# EAGLE design PSU-v2 (EAGLE 5.07)
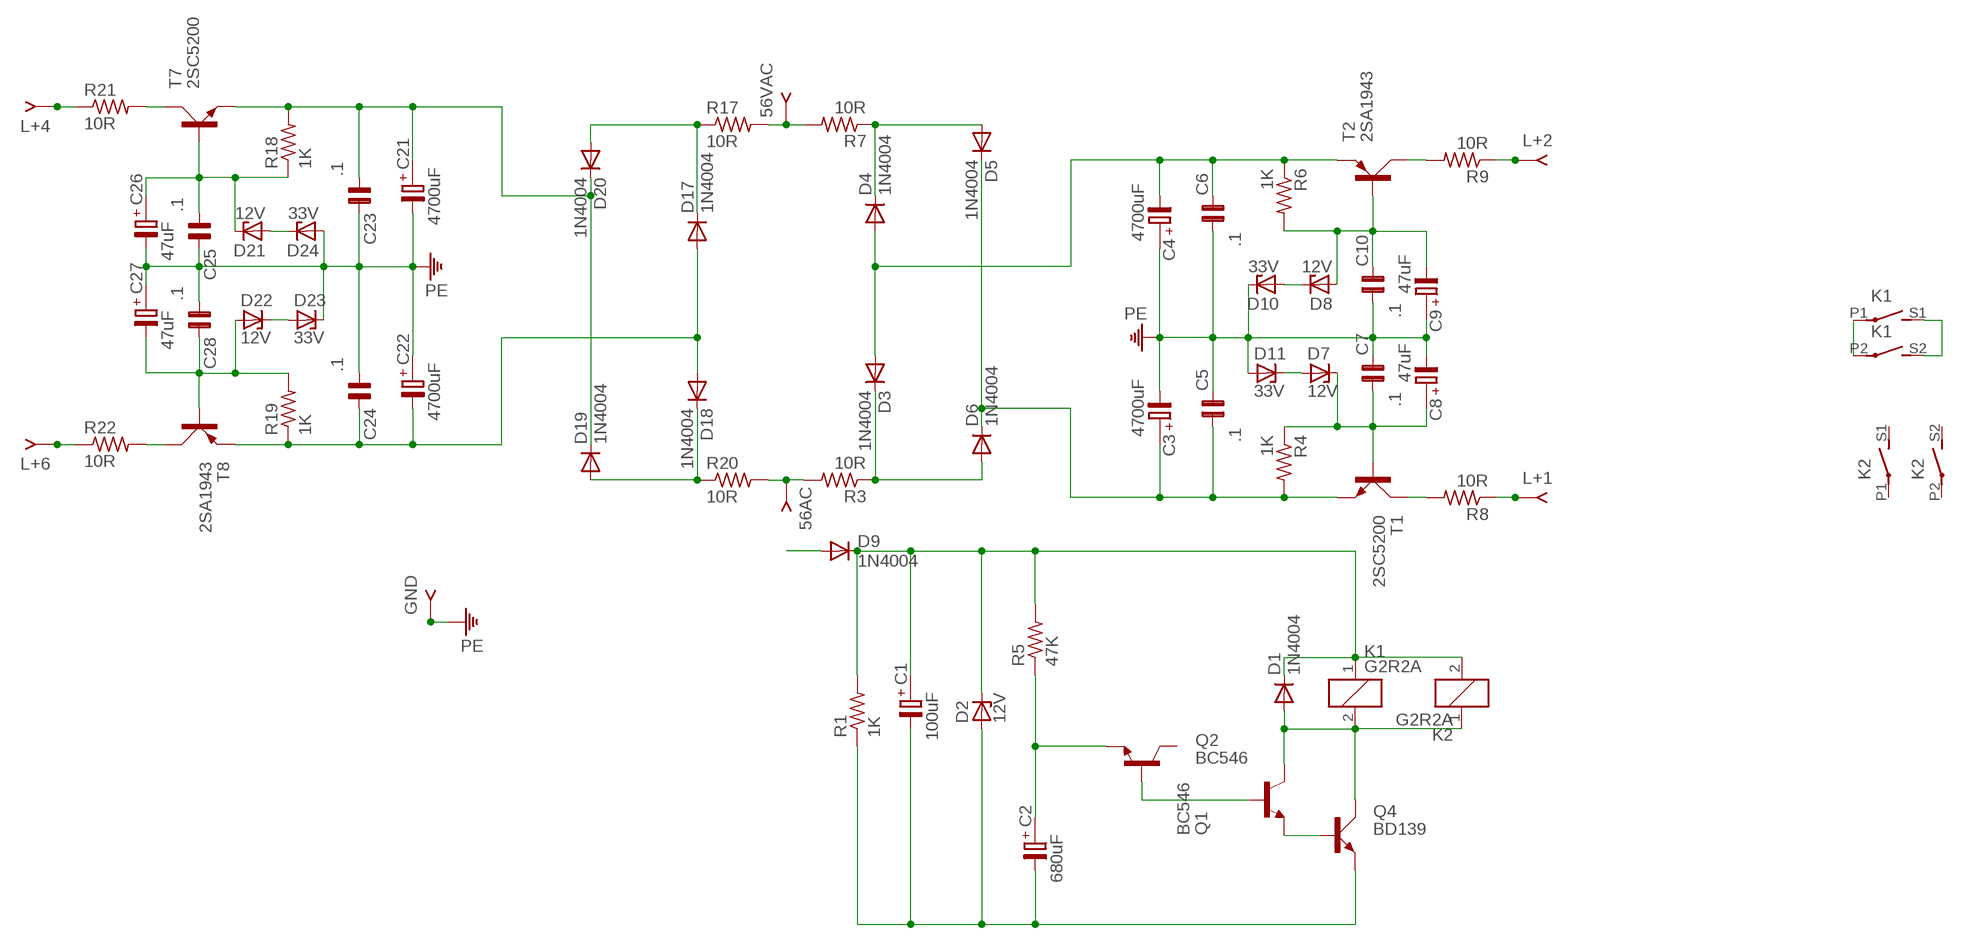
[diagram p0: schematic, sheet 1]

## Parts
56AC  QFIT  [FASTON]
56VAC  QFIT  [FASTON]
C1  100uF  C-PR-5,0X10  [E5,0-10]
C2  680uF  C-PR-5,0X10  [E5,0-10]
C3  4700uF  C-PR-7,5X16  [E7,5-16]
C4  4700uF  C-PR-7,5X16  [E7,5-16]
C5  .1  C-NP-7,5-11,0X7,0  [C7,5-11,0X7,0]
C6  .1  C-NP-7,5-11,0X7,0  [C7,5-11,0X7,0]
C7  .1  C-NP-7,5-11,0X7,0  [C7,5-11,0X7,0]
C8  47uF  C-PR-5,0X10  [E5,0-10]
C9  47uF  C-PR-5,0X10  [E5,0-10]
C10  .1  C-NP-7,5-11,0X7,0  [C7,5-11,0X7,0]
C21  4700uF  C-PR-7,5X16  [E7,5-16]
C22  4700uF  C-PR-7,5X16  [E7,5-16]
C23  .1  C-NP-7,5-11,0X7,0  [C7,5-11,0X7,0]
C24  .1  C-NP-7,5-11,0X7,0  [C7,5-11,0X7,0]
C25  .1  C-NP-7,5-11,0X7,0  [C7,5-11,0X7,0]
C26  47uF  C-PR-5,0X10  [E5,0-10]
C27  47uF  C-PR-5,0X10  [E5,0-10]
C28  .1  C-NP-7,5-11,0X7,0  [C7,5-11,0X7,0]
D1  1N4004  [DO41-10]
D2  12V  ZTK  [DO35Z10]
D3  1N4004  [DO41-10]
D4  1N4004  [DO41-10]
D5  1N4004  [DO41-10]
D6  1N4004  [DO41-10]
D7  12V  ZTK  [DO35Z10]
D8  12V  ZTK  [DO35Z10]
D9  1N4004  [DO41-10]
D10  33V  ZTK  [DO35Z10]
D11  33V  ZTK  [DO35Z10]
D17  1N4004  [DO41-10]
D18  1N4004  [DO41-10]
D19  1N4004  [DO41-10]
D20  1N4004  [DO41-10]
D21  12V  ZTK  [DO35Z10]
D22  12V  ZTK  [DO35Z10]
D23  33V  ZTK  [DO35Z10]
D24  33V  ZTK  [DO35Z10]
GND  QFIT  [FASTON]
K1  G2R2A  [G2R2A]
K2  G2R2A  [G2R2A]
L+1  QFIT  [FASTON]
L+2  QFIT  [FASTON]
L+4  QFIT  [FASTON]
L+6  QFIT  [FASTON]
Q1  BC546  BC549B  [TO92-EBC]
Q2  BC546  BC546A  [TO92-EBC]
Q4  BD139  [TO126AV]
R1  1K  R-US_0309/12  [0309/12]
R3  10R  R-US_0617/22  [0617/22]
R4  1K  R-US_0309/12  [0309/12]
R5  47K  R-US_0309/12  [0309/12]
R6  1K  R-US_0309/12  [0309/12]
R7  10R  R-US_0617/22  [0617/22]
R8  10R  R-US_0617/22  [0617/22]
R9  10R  R-US_0617/22  [0617/22]
R17  10R  R-US_0617/22  [0617/22]
R18  1K  R-US_0309/12  [0309/12]
R19  1K  R-US_0309/12  [0309/12]
R20  10R  R-US_0617/22  [0617/22]
R21  10R  R-US_0617/22  [0617/22]
R22  10R  R-US_0617/22  [0617/22]
T1  2SC5200  TIP3055  [TOP3AV]
T2  2SA1943  TIP2955  [TOP3AV]
T7  2SC5200  TIP3055  [TOP3AV]
T8  2SA1943  TIP2955  [TOP3AV]

## Nets
N$1: K1.S1(2:S) K1.S2(3:S)
N$4: C1.- C2.- D2.A Q4.E R1.1
N$5: D4.C D5.A R7.1
N$7: Q2.E Q4.B
N$8: K1.P1(2:P) K1.P2(3:P)
N$9: D3.C D6.A R3.1
N$10: C3.+ C5.1 D5.C D6.C R4.2 T1.E
N$11: C1.+ D1.C D2.C D9.C K1.1 K2.2 R1.2 R5.2
N$12: C4.- C6.2 D3.A D4.A R6.1 T2.E
N$13: C7.1 C8.+ D7.C R4.1 T1.B
N$14: D9.A
N$15: Q1.B Q2.B
N$16: C9.- C10.2 D8.A R6.2 T2.B
N$17: C2.+ Q1.E R5.1
N$18: R8.2 T1.C
N$20: D1.A K1.2 K2.1 Q2.C Q4.C
N$21: 56VAC.1 56VAC.2 R7.2 R17.2
N$23: R9.2 T2.C
N$25: D8.C D10.A
N$26: D7.A D11.C
N$27: L+1.1 L+1.2 R8.1
N$28: D18.C D19.A R20.1
N$29: L+2.1 L+2.2 R9.1
N$32: D17.C D20.A R17.1
N$33: C21.+ C23.1 D19.C D20.C R18.2 T7.E
N$36: C22.- C24.2 D17.A D18.A R19.1 T8.E
N$37: C25.1 C26.+ D21.C R18.1 T7.B
N$38: C27.- C28.2 D22.A R19.2 T8.B
N$39: R21.2 T7.C
N$40: R22.2 T8.C
N$41: D22.C D23.A
N$42: D21.A D24.C
N$43: 56AC.1 56AC.2 R3.2 R20.2
N$44: L+4.1 L+4.2 R21.1
N$45: L+6.1 L+6.2 R22.1
PE: C3.- C4.+ C5.2 C6.1 C7.2 C8.- C9.+ C10.1 C21.- C22.+ C23.2 C24.1 C25.2 C26.- C27.+ C28.1 D10.C D11.A D23.C D24.A GND.1 GND.2
Unconnected: K2.P1(2:P) K2.P2(3:P) K2.S1(2:S) K2.S2(3:S) Q1.C

## Library data of the parts
56AC 56VAC GND L+1 L+2 L+4 L+6 = keystone:QFIT: QUICKFIT PCB TERMINAL
C1-C4 C8 C9 C21 C22 C26 C27 = cap-pan40:C-PR: POLARIZED ELECTROLYTIC/TANTALUM
C5-C7 C10 C23-C25 C28 = cap-pan40:C-NP: NON-POLARIZED FILM/CHIP
D1 D3-D6 D9 D17-D20 = diode:1N4004: DIODE general purpose rectifier, 1 A
D2 D7 D8 D10 D11 D21-D24 = diode:ZTK: Z DIODE
K1 K2 = relay:G2R2A: RELAY 2 x norm. open, Omron
Q1 = transistor-npn:BC549*: NPN Transistor
Q2 = transistor-npn:BC546*: NPN Transistor
Q4 = transistor-power:BD139: NPN TRANSISTOR
R1 R3-R9 R17-R22 = resistor:R-US_: RESISTOR, American symbol
T1 T7 = transistor-power:TIP3055: NPN TRANSISTOR
T2 T8 = transistor-power:TIP2955: PNP TRANSISTOR

## Board
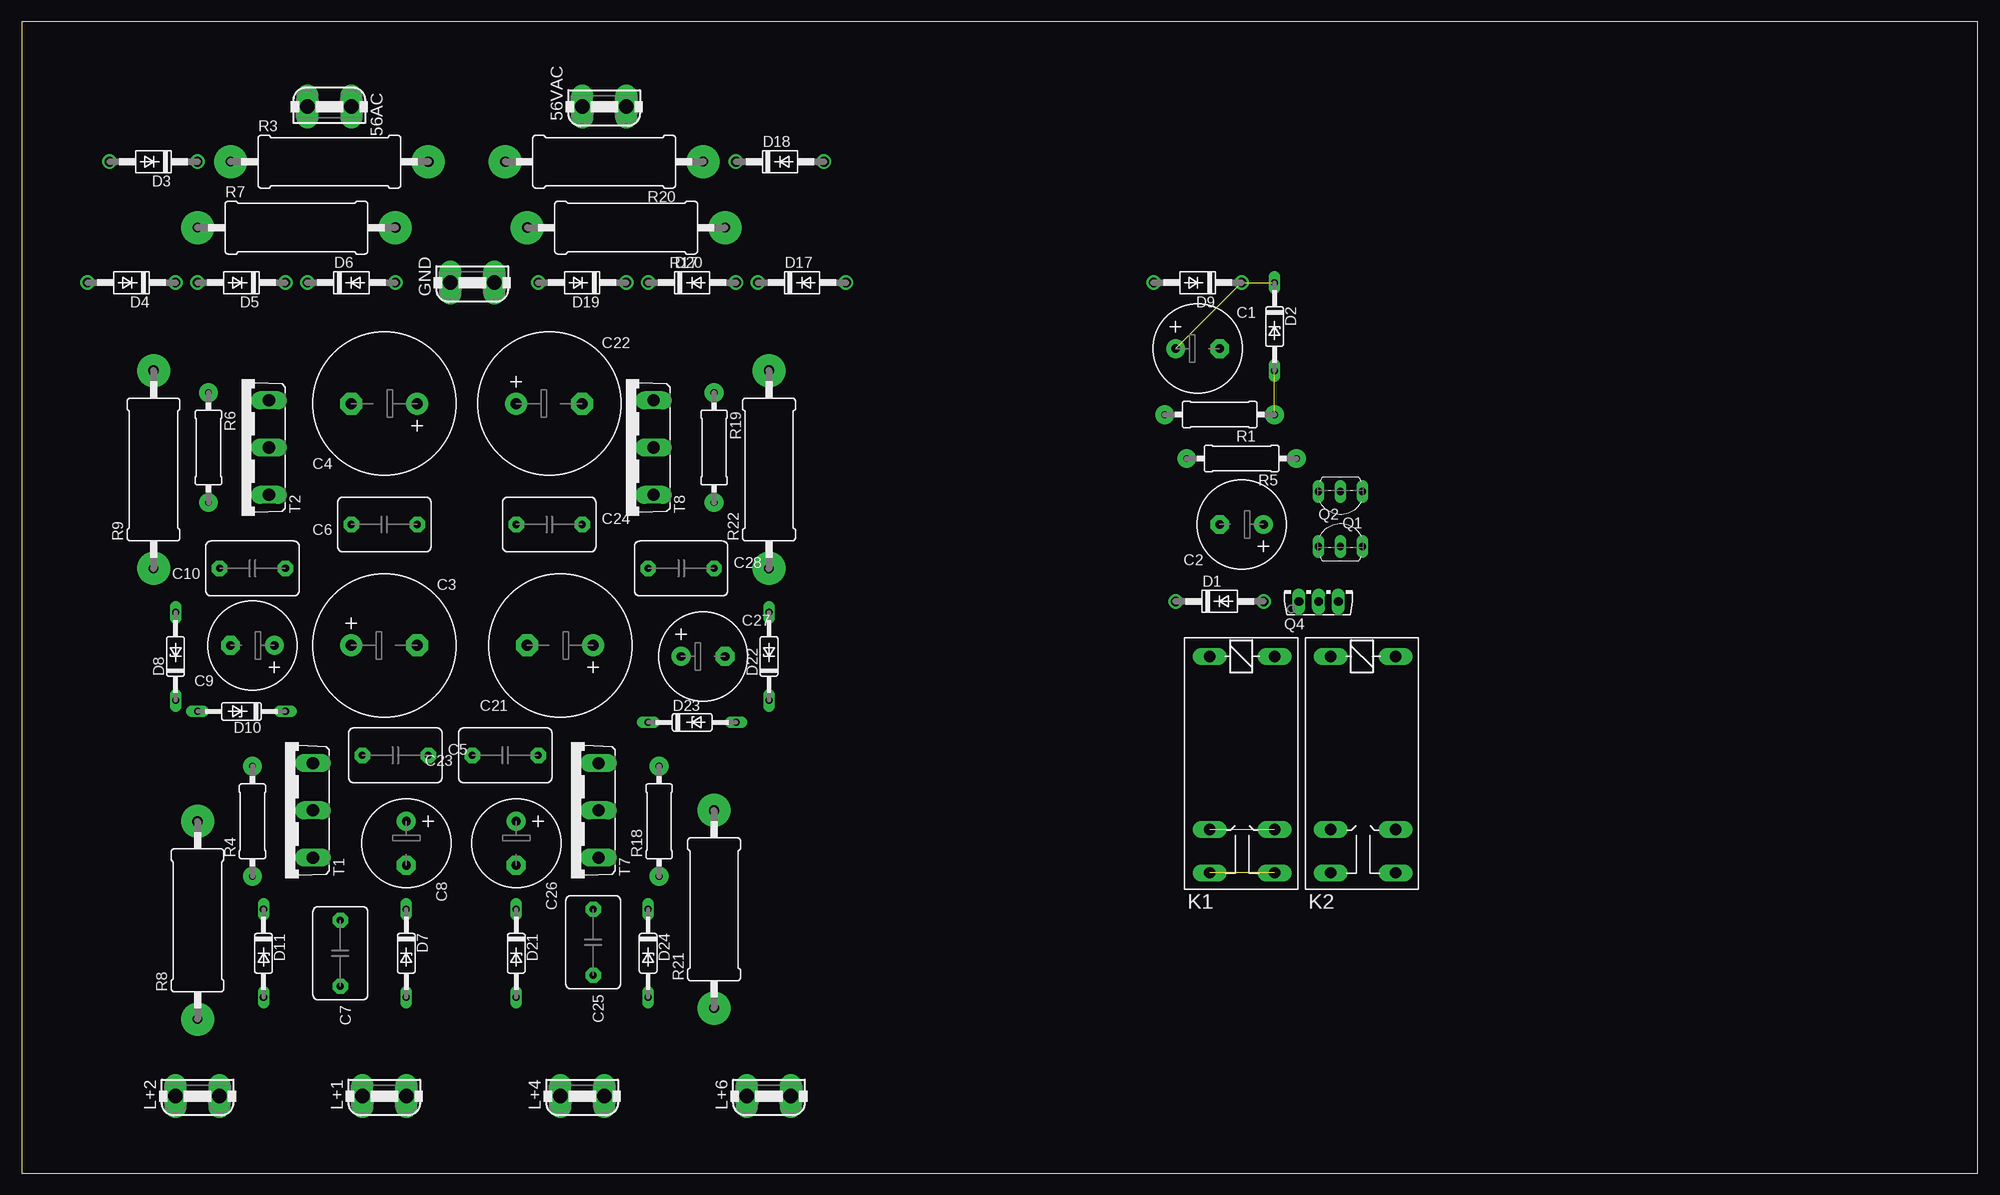
[diagram p1: board, top side]
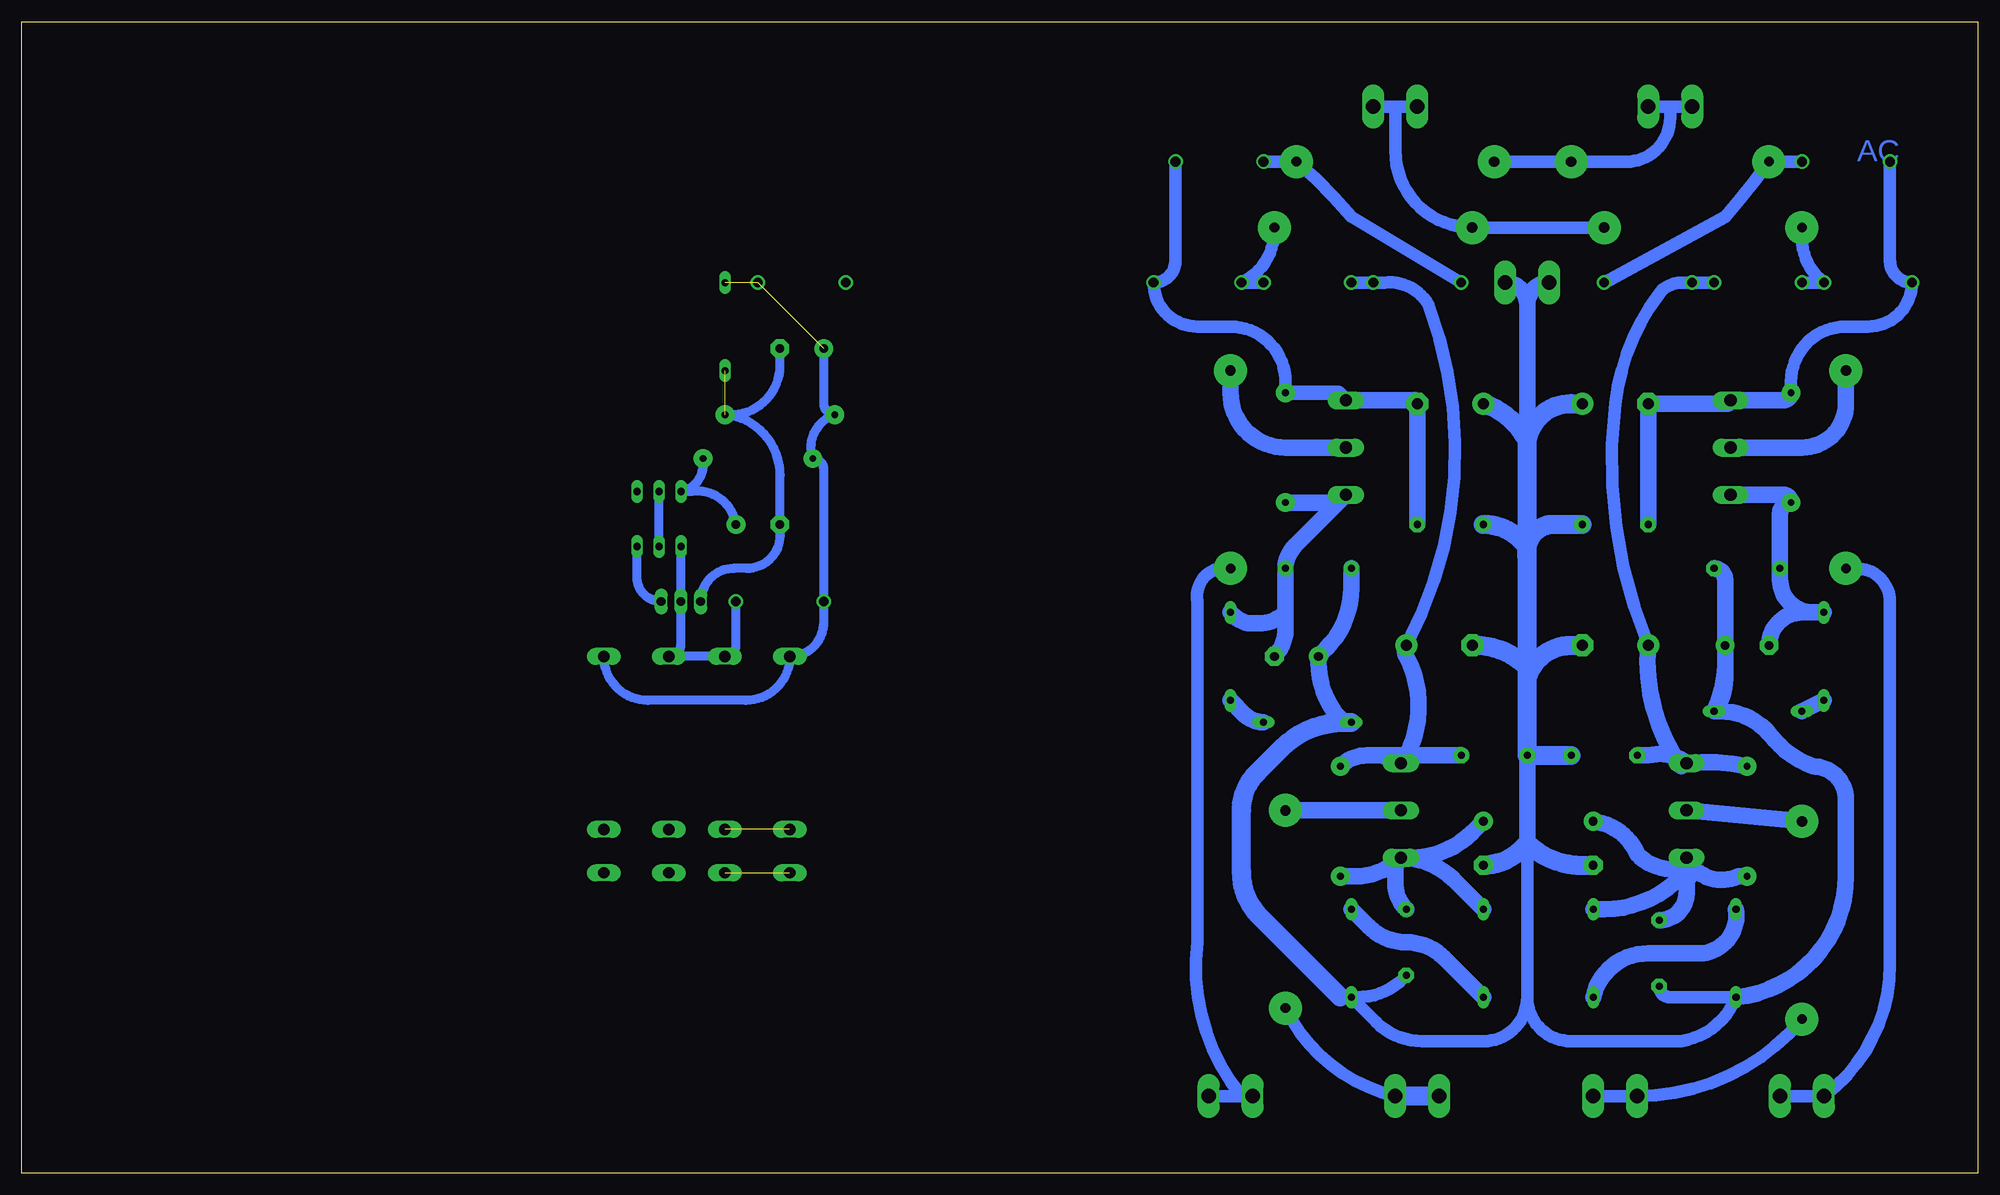
[diagram p2: board, bottom side, seen from below]

Size 226.04 x 133.02 mm. Coordinates in mm from the lower left corner, seen from the top.
Outline: 0,0 226.04,0 226.04,133.02 0,133.02 0,0
Copper layers (1*16): Top 0.035mm / dielectric 1.5mm / Bottom 0.035mm
Design rules "default": minimum track width 10mil, minimum drill 24mil, track to track 8mil, track to pad 8mil, pad to pad 8mil, via to via 8mil, smd to smd 8mil, copper to edge 40mil, drill to drill 8mil, minimum pad ring 10mil, minimum via ring 8mil, stop-mask expansion 4mil, vias tented up to drill 0mil, thermal gap 10mil

### Footprints (pad centres in the part's own frame; a part is rotated, then mirrored left to right if it is on the bottom)
FASTON = drill 1.676 pad 2.54 long: 1 -2.54,0; 2 2.54,0
E5,0-10 = drill 1.016 pad 2.184 round: + -2.54,0 | drill 1.016 pad 2.184 octagon: - 2.54,0
E7,5-16 = drill 1.27 pad 2.54 round: + -3.81,0 | drill 1.27 pad 2.54 octagon: - 3.81,0
C7,5-11,0X7,0 = drill 0.813 pad 1.778 octagon: 1 -3.81,0; 2 3.81,0
DO41-10 = drill 1.118 round: A 5.08,0; C -5.08,0
DO35Z10 = drill 0.813 long: A 5.08,0; C -5.08,0
G2R2A = drill 1.321 long: 1 -2.54,-3.683; 2 -2.54,3.81; P1 17.45,3.81; P2 17.45,-3.683; S1 22.454,3.81; S2 22.454,-3.683
TO92-EBC = drill 0.813 long: B 0,-1.27; C -2.54,-1.27; E 2.54,-1.27
TO126AV = drill 1.016 long: B 2.286,-1.27; C 0,-1.27; E -2.286,-1.27
0309/12 = drill 0.8 pad 2.184 round: 1 -6.35,0; 2 6.35,0
0617/22 = drill 1.1 pad 3.81 round: 1 -11.43,0 | drill 1.2 pad 3.81 round: 2 11.43,0
TOP3AV = drill 1.397 long: B -5.461,-3.175; C 0,-3.175; E 5.461,-3.175

### Placement (x,y rotation side)
56AC  35.56,123.19 180 top
56VAC  67.31,123.19 0 top
C1  135.89,95.25 0 top
C2  140.97,74.93 180 top
C3  41.91,60.96 0 top
C4  41.91,88.9 180 top
C5  43.18,48.26 0 top
C6  41.91,74.93 180 top
C7  36.83,25.4 270 top
C8  44.45,38.1 270 top
C9  26.67,60.96 180 top
C10  26.67,69.85 180 top
C21  62.23,60.96 180 top
C22  60.96,88.9 0 top
C23  55.88,48.26 180 top
C24  60.96,74.93 0 top
C25  66.04,26.67 270 top
C26  57.15,38.1 270 top
C27  78.74,59.69 0 top
C28  76.2,69.85 0 top
D1  138.43,66.04 0 top
D2  144.78,97.79 270 top
D3  15.24,116.84 180 top
D4  12.7,102.87 180 top
D5  25.4,102.87 180 top
D6  38.1,102.87 0 top
D7  44.45,25.4 270 top
D8  17.78,59.69 90 top
D9  135.89,102.87 180 top
D10  25.4,53.34 180 top
D11  27.94,25.4 270 top
D17  90.17,102.87 0 top
D18  87.63,116.84 0 top
D19  64.77,102.87 180 top
D20  77.47,102.87 0 top
D21  57.15,25.4 270 top
D22  86.36,59.69 90 top
D23  77.47,52.07 0 top
D24  72.39,25.4 270 top
GND  52.07,102.87 0 top
K1  140.97,57.15 270 top
K2  154.94,57.15 270 top
L+1  41.91,8.89 0 top
L+2  20.32,8.89 0 top
L+4  64.77,8.89 0 top
L+6  86.36,8.89 0 top
Q1  152.4,77.47 180 top
Q2  152.4,73.66 0 top
Q4  149.86,67.31 0 top
R1  138.43,87.63 180 top
R3  35.56,116.84 0 top
R4  26.67,40.64 90 top
R5  140.97,82.55 180 top
R6  21.59,83.82 270 top
R7  31.75,109.22 0 top
R8  20.32,29.21 90 top
R9  15.24,81.28 90 top
R17  69.85,109.22 180 top
R18  73.66,40.64 90 top
R19  80.01,83.82 270 top
R20  67.31,116.84 180 top
R21  80.01,30.48 90 top
R22  86.36,81.28 90 top
T1  30.48,41.91 90 top
T2  25.4,83.82 90 top
T7  63.5,41.91 90 top
T8  69.85,83.82 90 top

### Tracks (layer width: path | path; a pad name or v marks a point on that pad's centre or on a via)
N$1  (1 unrouted)
N$4  (1 unrouted)
  Bottom 1.016: C1.- 138.43,92.71 arc90 R1.1 arc90 138.43,80.01 C2.- 138.43,73.66 arc90 142.24,69.85 143.76,69.85 arc-90 Q4.E
N$5
  Bottom 1.422: D5.A D4.C arc53 20.32,107.95 R7.1
N$7
  Bottom 1.016: Q4.B arc90 154.94,68.83 Q2.E
N$8  (1 unrouted)
N$9
  Bottom 1.422: D6.A 29.21,110.49 arc-6 R3.1 D3.C
N$10
  Bottom 1.422: C3.+ arc29 41.91,88.9 arc30 36.83,101.6 arc53 34.29,102.87 D6.C D5.C
  Bottom 1.93: T1.E 34.29,46.99 arc41 C3.+ | C5.1 38.1,48.26 arc52 T1.E | R4.2 arc-18 T1.E
N$11  (2 unrouted)
  Bottom 1.016: K2.2 arc-90 153.67,54.61 142.37,54.61 arc-90 K1.1 arc-90 133.35,63.63 D1.C 133.35,81.28 arc-90 R5.2 arc90 R1.2 arc90 133.35,88.9 C1.+
N$12
  Bottom 1.422: R6.1 21.59,91.44 arc90 15.24,97.79 12.7,97.79 arc-90 D4.A arc90 10.16,105.41 D3.A
  Bottom 1.93: R6.1 arc90 22.48,89.28 T2.E arc90 28.96,88.9 C4.- C6.2
N$13
  Bottom 1.93: R4.1 27.69,34.29 arc90 T1.B | C7.1 arc-90 33.66,32.38 T1.B | T1.B arc90 33.27,34.29 | 33.27,34.29 33.02,35.56 arc67 39.37,36.83 arc-61 C8.+ | D7.C 43.18,30.48 arc-46 34.29,34.29 33.27,34.29
N$15
  Bottom 1.016: Q2.B Q1.B
N$16
  Bottom 1.93: T2.B 22.48,78.36 arc90 R6.2 arc-90 22.86,76.2 C10.2 22.86,68.58 arc-90 19.05,64.77 D8.A 20.32,64.77 arc-90 C9.-
N$17
  Bottom 1.016: R5.1 arc90 Q1.E 148.59,78.74 arc90 C2.+
N$18
  Bottom 1.93: R8.2 T1.C
N$20
  Bottom 1.016: Q2.C Q4.C 149.86,61.09 arc90 K2.1 K1.2 | K1.2 arc-90 143.51,60.96 | 143.51,60.96 D1.A | K1.2 arc-90 143.51,60.96
N$21
  Bottom 1.422: R7.2 R17.2 arc90 67.31,118.11 67.31,123.19 56VAC.1 56VAC.2
N$23
  Bottom 1.93: T2.C 20.32,83.82 arc-90 15.24,88.9 R9.2
N$25
  Bottom 1.93: D8.C D10.A
N$26
  Bottom 1.93: D11.C arc90 31.75,25.4 38.1,25.4 arc-77 D7.A
N$27
  Bottom 1.422: L+1.2 L+1.1 arc-50 R8.1
N$28
  Bottom 1.422: D19.A 72.39,110.49 arc-10 R20.1 D18.C
N$29
  Bottom 1.422: R9.1 13.97,69.85 arc90 10.16,66.04 10.16,24.13 arc53 L+2.1 L+2.2
N$32
  Bottom 1.422: D20.A D17.C arc-67 R17.1
N$33
  Bottom 1.422: D20.C D19.C 68.58,102.87 arc67 63.5,100.33 arc49 C21.+
  Bottom 1.93: 68.58,48.26 70.59,48.26 arc-45 R18.2 | T7.E arc45 68.41,48.09 68.58,48.26 | 66.04,48.26 C23.1 | 66.04,48.26 68.58,48.26 | C21.+ arc-56 66.04,59.69 arc56 66.04,48.26
N$36
  Bottom 1.422: R19.1 80.01,91.44 arc-90 86.36,97.79 90.17,97.79 arc90 D17.A arc-90 92.71,105.41 D18.A
  Bottom 1.676: T8.E 73.91,90.17 R19.1
  Bottom 1.93: C24.2 C22.- arc-90 65.15,89.28 T8.E
N$37
  Bottom 1.93: C26.+ 58.41,39.38 arc45 65.48,36.45 T7.B | T7.B arc45 71.89,34.29 R18.1 | C25.1 arc45 67.31,33.55 67.31,35.56 66.86,36.02 arc-45 T7.B | D21.C 60.6,33.93 arc-45 T7.B
N$38
  Bottom 1.93: C27.- arc-45 80.01,62.76 80.01,64.77 | 80.01,64.77 C28.2 arc45 78.93,72.45 T8.B arc45 75.17,77.47 R19.2 | D22.A 85.99,64.4 arc-45 83.82,63.5 83.08,63.5 arc-45 80.01,64.77
N$39
  Bottom 1.93: T7.C R21.2
N$40
  Bottom 1.93: T8.C 80.01,83.82 arc90 86.36,90.17 R22.2
N$41
  Bottom 1.93: D23.A arc45 84.72,52.97 D22.C
N$42
  Bottom 1.93: D21.A 61.7,24.87 arc-45 66.04,26.67 arc45 70.38,28.47 D24.C
N$43
  Bottom 1.422: R20.2 R3.2 40.64,116.84 arc-90 35.56,121.92 35.56,123.19 | 35.56,123.19 56AC.2 | 35.56,123.19 56AC.1
N$44
  Bottom 1.422: L+4.2 arc50 R21.1
  Bottom 2.184: L+4.1 L+4.2
N$45
  Bottom 1.422: R22.1 87.63,69.85 arc-90 90.17,66.04 90.17,26.67 arc-46 85.09,8.89 | 85.09,8.89 L+6.2 | 85.09,8.89 L+6.1
PE
  Bottom 1.422: C25.2 66.38,22.52 arc45 71.69,20.32 D24.A 69.51,17.44 arc-45 64.2,15.24 57.15,15.24 arc-90 52.07,20.32 | 52.07,20.32 52.07,38.1 | 52.07,20.32 arc-90 46.99,15.24 34.29,15.24 arc-59 D11.A 35.56,20.32 arc90 C7.2
  Bottom 1.676: 73.33,52.07 74.93,52.07 | D24.A 73.66,20.32
  Bottom 1.93: 52.07,38.1 C23.2 | 52.07,57.15 52.07,71.12 | 73.33,52.07 arc45 76.2,59 C27.+ 75.32,60.57 arc-45 72.39,67.64 C28.1 | C9.+ 29.21,58.42 arc23 D10.C | C9.+ 29.21,68.58 arc-90 C10.1 | C9.+ 29.21,57.15 arc37 D10.C | D10.C arc53 24.13,50.8 arc-33 19.05,46.99 arc90 15.24,43.18 15.24,34.29 arc85 D11.A | 52.07,100.33 arc90 GND.1 | 52.07,83.82 52.07,100.33 | 52.07,100.33 arc-90 GND.2
  Bottom 2.184: 73.66,20.32 82.89,29.55 arc45 85.09,34.86 85.09,41.91 arc45 83.29,46.25 80.4,49.14 arc45 73.33,52.07 D23.C | 52.07,57.15 52.07,58.42 | 52.07,57.15 C23.2 C5.2 | 52.07,58.42 52.07,71.12 | 52.07,71.12 52.07,72.39 | 52.07,72.39 52.07,83.82 52.07,84.56 | 52.07,84.56 arc-45 C22.+ | C24.1 arc45 52.81,73.13 52.07,72.39 | C21.- 58.2,60.96 arc45 52.07,58.42 | C26.- arc-45 52.81,37.36 52.07,38.1 arc-44 45.72,35.56 C8.- | C3.- 46.99,60.96 arc-74 52.07,57.15 | C6.1 49.53,74.93 arc-90 52.07,71.12 | C4.+ 46.99,88.9 arc-81 52.07,84.56

### Text on the board
Bottom: AC